# Altium schematic sheet Sheet1.SchDoc: =Power Regulator+LED Sheild PCB for Ardino Uno
size A; DrawnBy: *ESHWARI PARDESHI; SheetNumber: 1; SheetTotal: 1
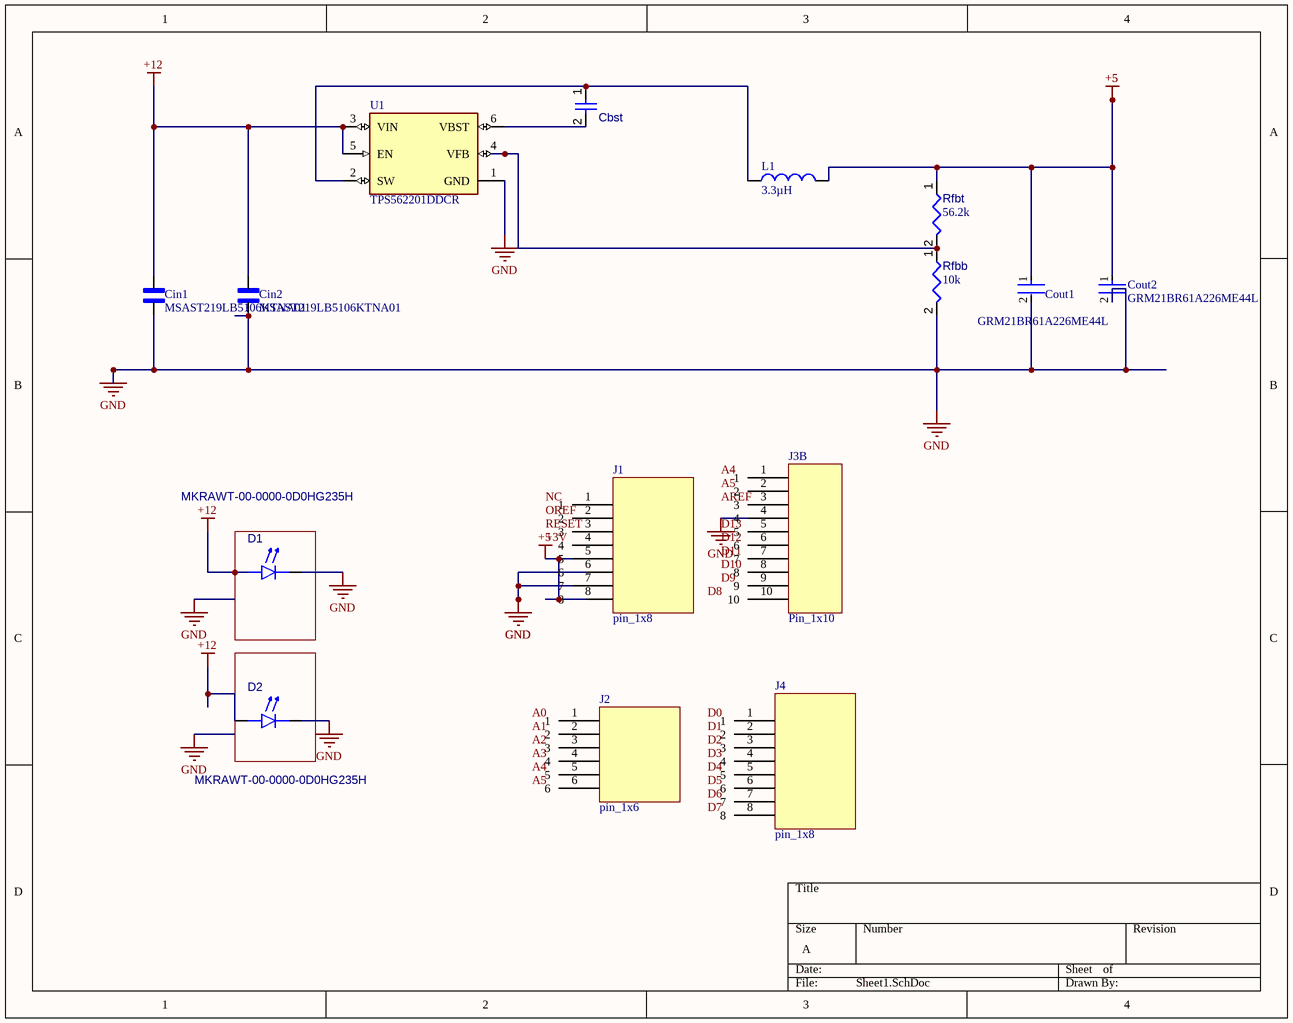
[diagram p0: Sheet1.SchDoc]

## Parts
Cbst  AVX 08053C104KAT2A  (value not drawn)
Cin1  MSAST219LB5106KTNA01  [CAPC2012X95N]
Cin2  MSAST219LB5106KTNA01  [CAPC2012X95N]
Cout1  GRM21BR61A226ME44L  [FP-GRM21B-0_2-e0_2_0_7-IPC_C]
Cout2  GRM21BR61A226ME44L  [FP-GRM21B-0_2-e0_2_0_7-IPC_C]
D1  MKRAWT-00-0000-0D0HG235H
D2  MKRAWT-00-0000-0D0HG235H
J1  pin_1x8  [Pin_1x8_2.54mm]
J2  pin_1x6  [Pin1x6_2.54mm]
J3  Pin_1x10  [Pin_1x10_2.54mm]  (part B of 2)
J4  pin_1x8  [Pin_1x8_2.54mm]
L1  value 3.3µH  (hidden comment: NPI43C3R3MTRF)
Rfbb  value 10k  (hidden comment: RC0201FR-0710KL)
Rfbt  value 56.2k  (hidden comment: RC0201FR-0756K2L)
U1  TPS562201DDCR  [FP-DDC0006A-IPC_C]

## Nets
+5: Cout1.1 Cout2.1 L1.2 Rfbt.1
+12: Cin1.2 Cin2.2 D1.2(A) D2.2(A) U1.3(VIN) U1.5(EN)
GND: Cin1.1 Cin2.1 Cout1.2 Cout2.2 D1.1(K) D2.1(K) Rfbb.2 U1.1(GND)
NetCbst_1: Cbst.1 L1.1 U1.2(SW)
NetCbst_2: Cbst.2 U1.6(VBST)
NetRfbb_1: Rfbb.1 Rfbt.2 U1.4(VFB)

Not connected (* = marked no-connect by the designer): J1 1 2 3 4 5 6 7 8; J2 1 2 3 4 5 6; J3 1 2 3 4 5 6 7 8 9 10; J4 1 2 3 4 5 6 7 8

## Notes on the sheet
- Labels drawn without touching a wire or pin: +3V, A0, A1, A2, A3, A4, A5, AREF, D0, D1, D2, D3, D4, D5, D6, D7, D8, D9, D10, D11, D12, D13, NC, OREF, RESET

## Library data of the parts
Cbst = CMP-001-00085-1
Cin1 Cin2 = MSAST219LB5106KTNA01: MF: {'manufacturer': u'Taiyo Yuden'}; Package: None; Price: None; Value: *; MP: MSAST219LB5106KTNA01; Availability: Unavailable
Cout1 Cout2 = CMP-06035-039918-1: Chip Multilayer Ceramic Capacitors for General Purpose, 0805, 22uF, X5R, 15%, 20%, 10V; Dissipation Factor: 0.035%; Min Operating Temperature: -55°C; Voltage Rating (DC): 10V; Height: 1.25mm; Depth: 1.25mm; Max Operating Temperature: 85°C; Width: 1.25mm; Lead Free: Lead Free; Dielectric Material: Ceramic; Weight: 0.000335oz; Tolerance: 20%; Voltage Rating: 10V; Case Code (Metric): 2012; Termination: SMD/SMT; Length: 2mm; Thickness: 0.057inch; Case/Package: 0805; Packaging: Tape and Reel; Voltage: 10V; Case Code (Imperial): 0805; Resistor Type: Ceramic; Package Quantity: 3000; Mount: Surface Mount; Capacitance: 22uF; Dielectric: X5R
D1 D2 = CMP-007-00037-1: Single Color LED, Neutral White, 6.5mm; Forward Current: 1.25A; Forward Voltage: 14V; Mounting Technology: Surface Mount; Case/Package: SMD/SMT; Max Operating Temperature: 85°C
L1 = CMP-006-00021-1: Inductor Power Unshielded Wirewound 3.3uH 20% 100KHz 2A 0.07Ohm DCR T/R; Max Operating Temperature: 125°C; Current Rating: 2A; Case/Package: 1816; Max Current Rating: 2A; Min Operating Temperature: -40°C; Tolerance: 20%
Rfbb = CMP-009-00177-1: Res Thick Film 0201 10K Ohm 1% 0.05W(1/20W) ±200ppm/C Pad SMD T/R; Voltage Rating: 25V; Pins: 2; Case/Package: 0201; Mounting Technology: Surface Mount; Min Operating Temperature: -55°C; Max Operating Temperature: 125°C; Tolerance: 1%
Rfbt = CMP-009-00179-1: Res Thick Film 0201 56.2K Ohm 1% 0.05W(1/20W) ±200ppm/C Pad SMD T/R; Voltage Rating: 25V; Max Operating Temperature: 125°C; Case/Package: 0201; Tolerance: 1%; Min Operating Temperature: -55°C; Mounting Technology: Surface Mount
U1 = CMP-04918-000361-1: IC REG BUCK ADJ 2A TSOT23-6; Switching Frequency: 580kHz; Max Input Voltage: 17V; Number of Outputs: 1; Output Voltage: 7V; Output Type: Adjustable; Quiescent Current: 400uA; Min Input Voltage: 4.5V; Mount: Surface Mount; Max Operating Temperature: 125°C; Lead Free: Lead Free; Operating Supply Voltage: 17V; Number of Pins: 6; RoHS Compliant: Yes; Contact Plating: Tin; Min Operating Temperature: -40°C; Case/Package: SOT; Max Output Current: 2A